# Altium schematic sheet Root.SchDoc
size A4; SheetNumber: 1; SheetTotal: 6
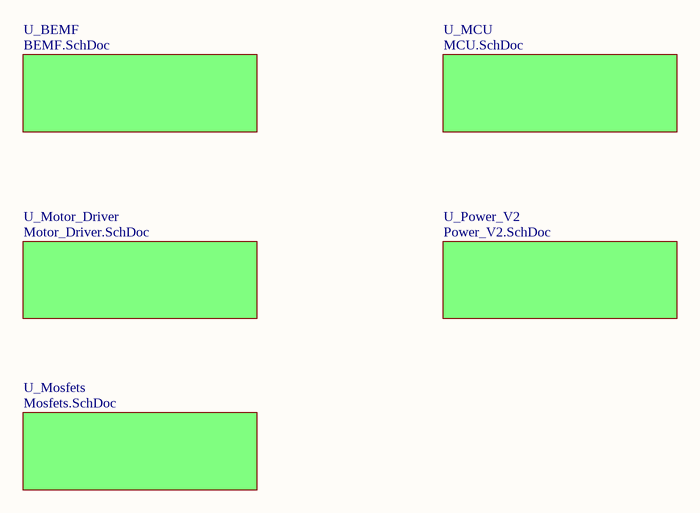
[diagram p0: Root.SchDoc]

## Sub-sheets
U_BEMF = BEMF.SchDoc: no entries
U_MCU = MCU.SchDoc: no entries
U_Mosfets = Mosfets.SchDoc: no entries
U_Motor_Driver = Motor_Driver.SchDoc: no entries
U_Power_V2 = Power_V2.SchDoc: no entries